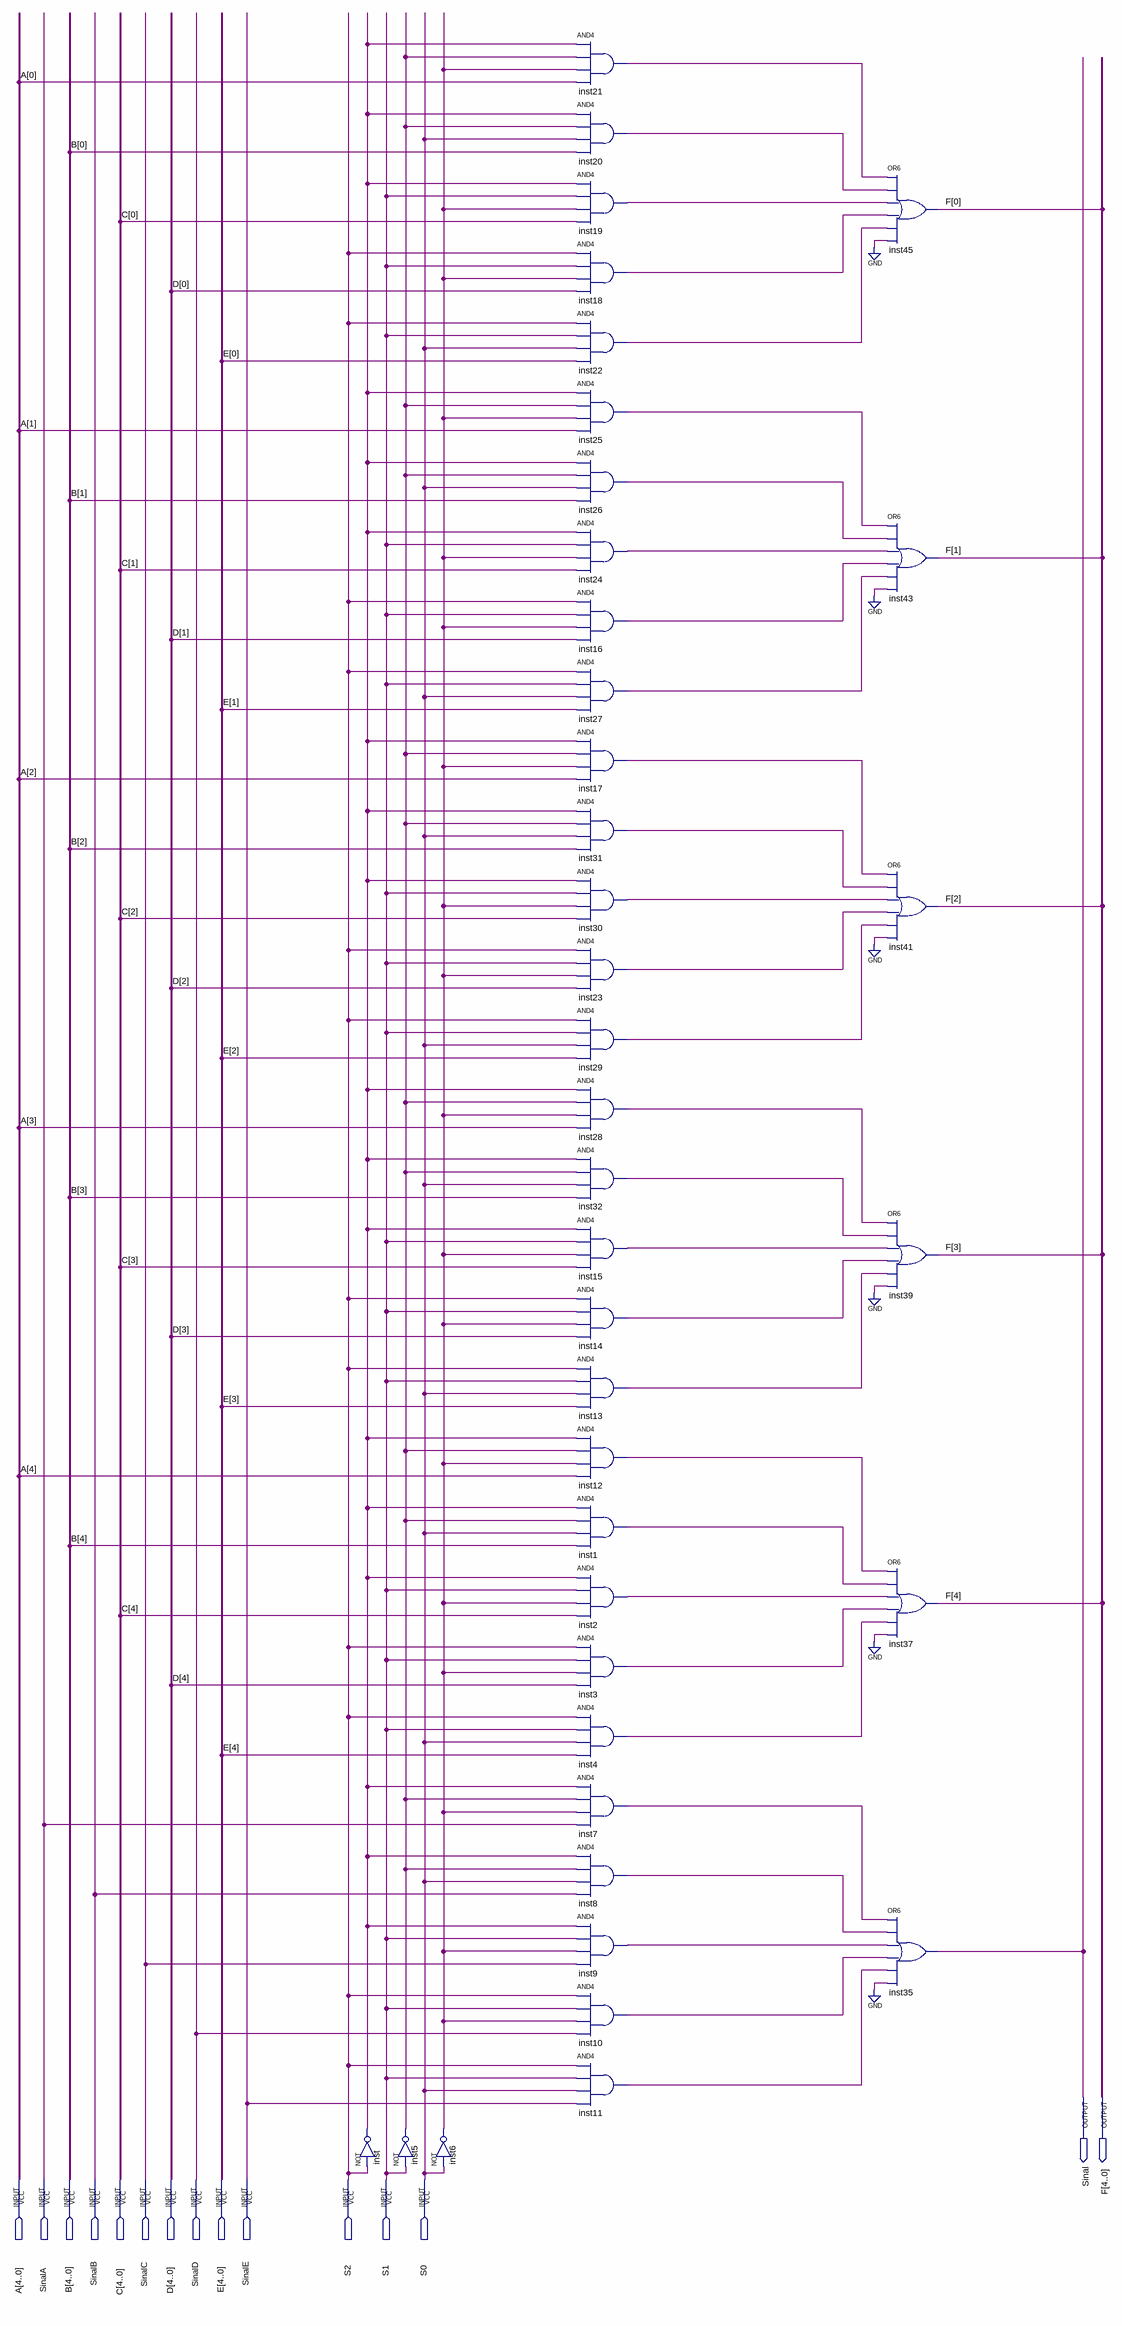
[diagram p0: schematic sheet]
// Quartus schematic Mux5x1.bdf as structural Verilog: 39 symbols, 15 pins
module Mux5x1 (
  input  [4:0] A,
  input  SinalA,
  input  [4:0] B,
  input  SinalB,
  input  [4:0] C,
  input  SinalC,
  input  [4:0] D,
  input  SinalD,
  input  [4:0] E,
  input  SinalE,
  input  S2,
  input  S1,
  input  S0,
  output Sinal,
  output [4:0] F
);

  wire inst1_out, inst2_out, inst3_out, inst4_out, inst5_out, inst6_out, inst7_out, inst8_out, inst9_out,
       inst10_out, inst11_out, inst12_out, inst13_out, inst14_out, inst15_out, inst16_out, inst17_out,
       inst18_out, inst19_out, inst20_out, inst21_out, inst22_out, inst23_out, inst24_out, inst25_out,
       inst26_out, inst27_out, inst28_out, inst29_out, inst30_out, inst31_out, inst32_out, inst_out;

  not inst (inst_out, S2);
  not inst5 (inst5_out, S1);
  not inst6 (inst6_out, S0);
  and inst21 (inst21_out, inst_out, inst5_out, inst6_out, A[0]);
  and inst20 (inst20_out, inst_out, inst5_out, S0, B[0]);
  and inst19 (inst19_out, inst_out, S1, inst6_out, C[0]);
  and inst18 (inst18_out, S2, S1, inst6_out, D[0]);
  and inst22 (inst22_out, S2, S1, S0, E[0]);
  and inst25 (inst25_out, inst_out, inst5_out, inst6_out, A[1]);
  and inst26 (inst26_out, inst_out, inst5_out, S0, B[1]);
  and inst24 (inst24_out, inst_out, S1, inst6_out, C[1]);
  and inst16 (inst16_out, S2, S1, inst6_out, D[1]);
  and inst27 (inst27_out, S2, S1, S0, E[1]);
  and inst17 (inst17_out, inst_out, inst5_out, inst6_out, A[2]);
  and inst31 (inst31_out, inst_out, inst5_out, S0, B[2]);
  and inst30 (inst30_out, inst_out, S1, inst6_out, C[2]);
  and inst23 (inst23_out, S2, S1, inst6_out, D[2]);
  and inst29 (inst29_out, S2, S1, S0, E[2]);
  and inst28 (inst28_out, inst_out, inst5_out, inst6_out, A[3]);
  and inst32 (inst32_out, inst_out, inst5_out, S0, B[3]);
  and inst15 (inst15_out, inst_out, S1, inst6_out, C[3]);
  and inst14 (inst14_out, S2, S1, inst6_out, D[3]);
  and inst13 (inst13_out, S2, S1, S0, E[3]);
  and inst12 (inst12_out, inst_out, inst5_out, inst6_out, A[4]);
  and inst1 (inst1_out, inst_out, inst5_out, S0, B[4]);
  and inst2 (inst2_out, inst_out, S1, inst6_out, C[4]);
  and inst3 (inst3_out, S2, S1, inst6_out, D[4]);
  and inst4 (inst4_out, S2, S1, S0, E[4]);
  and inst7 (inst7_out, inst_out, inst5_out, inst6_out, SinalA);
  and inst8 (inst8_out, inst_out, inst5_out, S0, SinalB);
  and inst9 (inst9_out, inst_out, S1, inst6_out, SinalC);
  and inst10 (inst10_out, S2, S1, inst6_out, SinalD);
  and inst11 (inst11_out, S2, S1, S0, SinalE);
  or inst45 (F[0], inst21_out, inst20_out, inst19_out, inst18_out, inst22_out, 1'b0);
  or inst43 (F[1], inst25_out, inst26_out, inst24_out, inst16_out, inst27_out, 1'b0);
  or inst41 (F[2], inst17_out, inst31_out, inst30_out, inst23_out, inst29_out, 1'b0);
  or inst39 (F[3], inst28_out, inst32_out, inst15_out, inst14_out, inst13_out, 1'b0);
  or inst37 (F[4], inst12_out, inst1_out, inst2_out, inst3_out, inst4_out, 1'b0);
  or inst35 (Sinal, inst7_out, inst8_out, inst9_out, inst10_out, inst11_out, 1'b0);
endmodule
